# EAGLE schematic Board_Vesion_1_27_2015 (EAGLE 6.5.0)
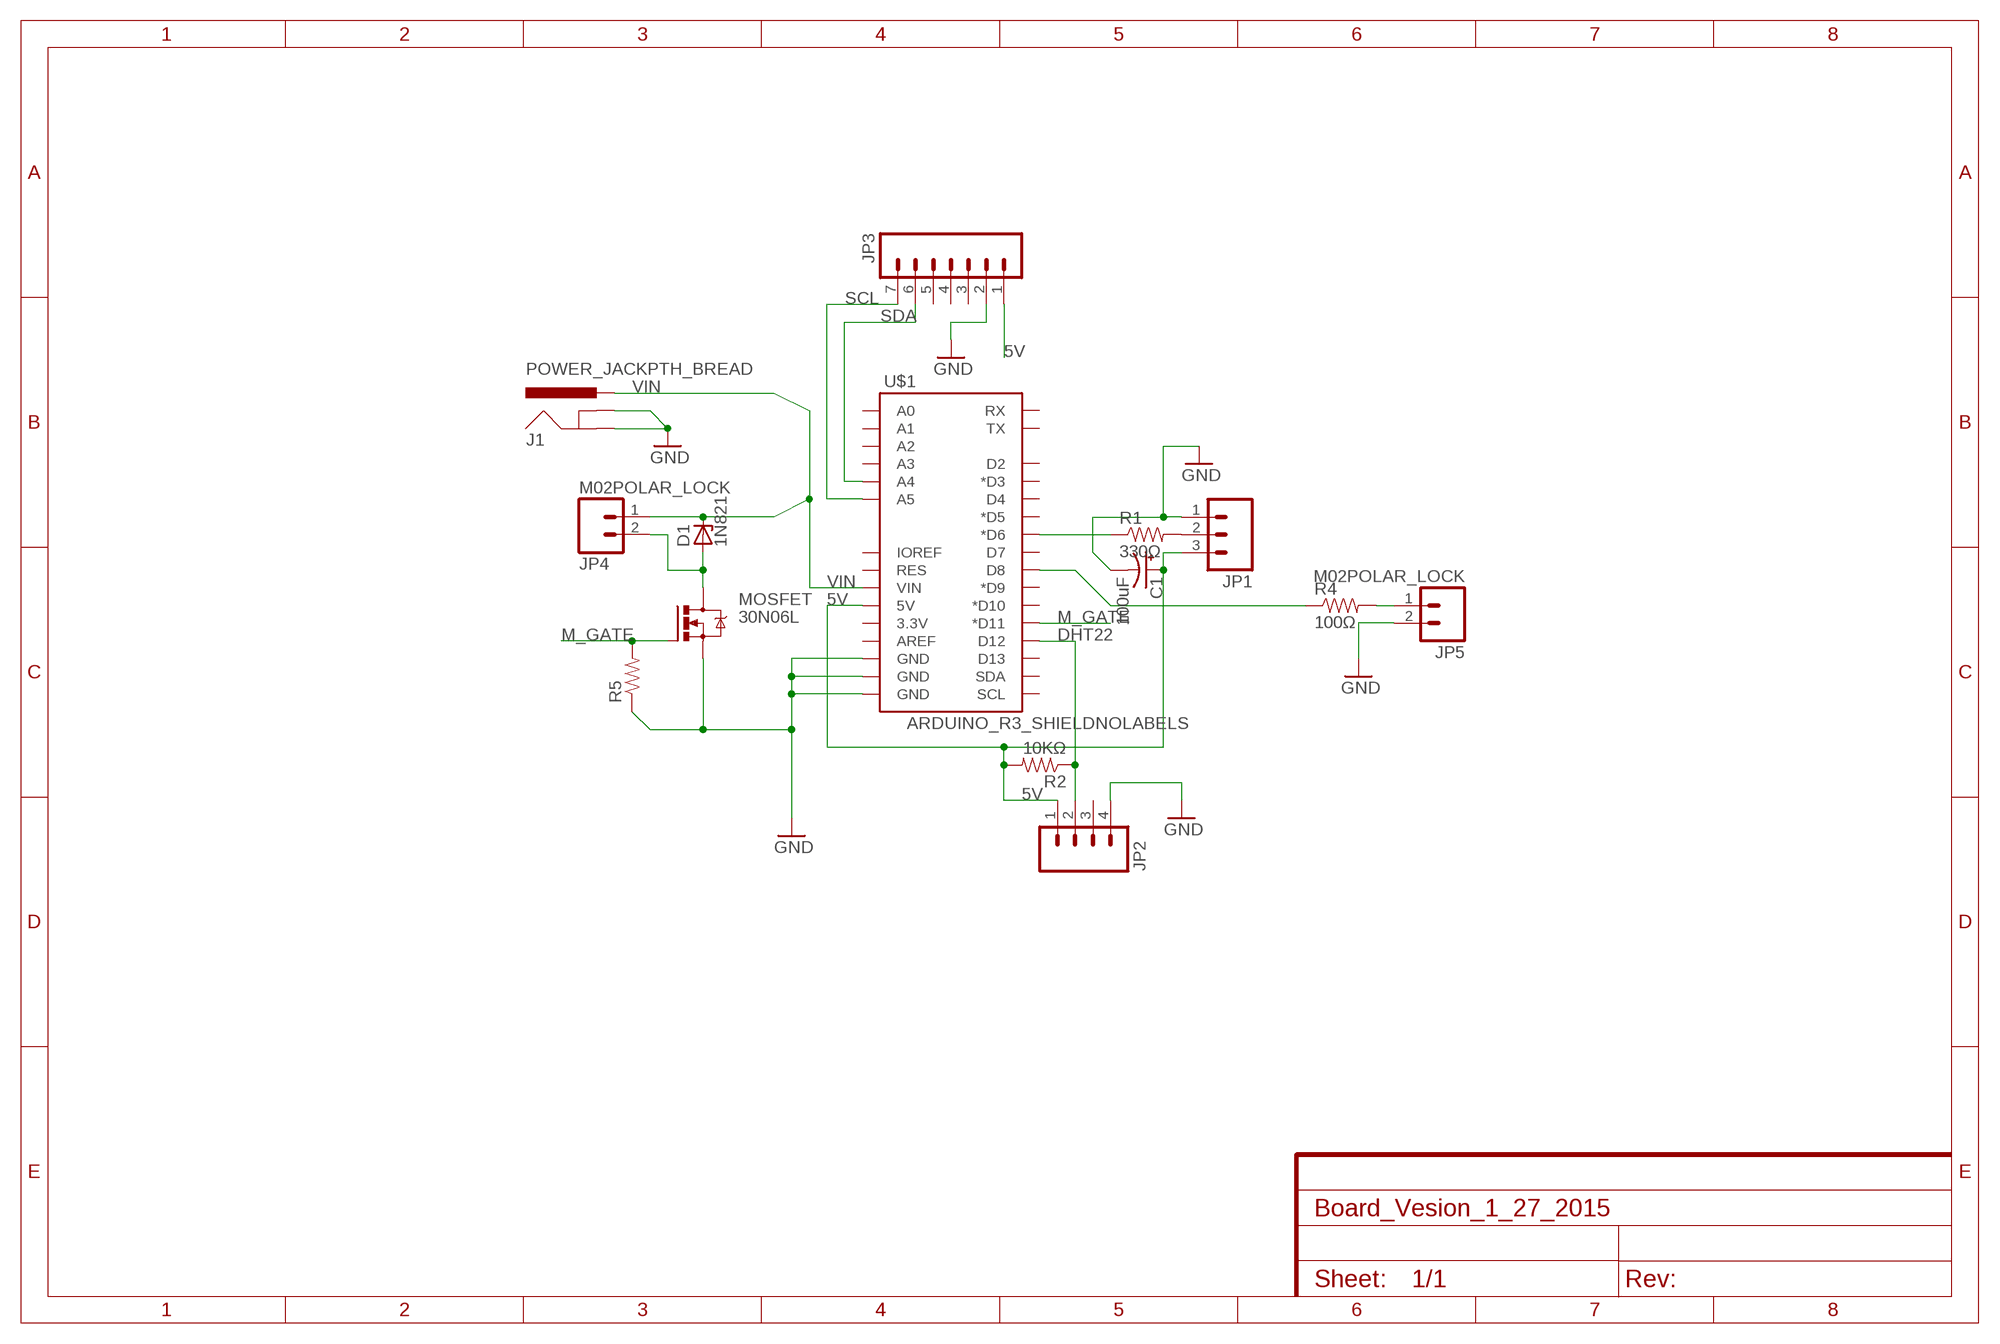
[diagram p0: schematic, sheet 1]

## Parts
C1  100uF  CAP_POLPTH2  [CPOL-RADIAL-10UF-25V]
D1  1N821  [DO35Z10]
J1  POWER_JACKPTH_BREAD  [POWER_JACK_PTH_BREAD]
JP1  M03LOCK_LONGPADS  [1X03_LOCK_LONGPADS]
JP2  M04LOCK_LONGPADS  [1X04_LOCK_LONGPADS]
JP3  M07LOCK_LONGPADS  [1X07_LOCK_LONGPADS]
JP4  M02POLAR_LOCK  [MOLEX-1X2_LOCK]
JP5  M02POLAR_LOCK  [MOLEX-1X2_LOCK]
MOSFET  30N06L  IRF740  [TO220BV]
R1  330Ω  RESISTORPTH-1/4W  [AXIAL-0.4]
R2  10KΩ  RESISTORPTH-1/4W  [AXIAL-0.4]
R4  100Ω  RESISTORPTH-1/4W  [AXIAL-0.4]
R5  RESISTORPTH-1W  [AXIAL-0.6]
U$1  ARDUINO_R3_SHIELDNOLABELS  [UNO_R3_SHIELD_NOLABELS]

## Nets
5V: C1.1(+) JP1.3 JP2.1 JP3.1 R2.P$2 U$1.5V
DHT22: JP2.2 R2.P$1 U$1.D12
GND: C1.2(-) J1.GND J1.GNDBREAK JP1.1 JP2.4 JP3.2 JP5.2 MOSFET.S R5.P$1 U$1.GND@0(GND) U$1.GND@1(GND) U$1.GND@2(GND)
M_GATE: MOSFET.G R5.P$2 U$1.D11(*D11)
N$1: JP1.2 R1.P$2
N$2: R4.P$1 U$1.D8
N$4: R1.P$1 U$1.D6(*D6)
N$5: D1.A JP4.2 MOSFET.D
N$6: JP5.1 R4.P$2
SCL: JP3.7 U$1.A5
SDA: JP3.6 U$1.A4
VIN: D1.C J1.PWR JP4.1 U$1.VIN
Unconnected: JP2.3 JP3.3 JP3.4 JP3.5 U$1.3.3V U$1.A0 U$1.A1 U$1.A2 U$1.A3 U$1.AREF U$1.D2 U$1.D3(*D3) U$1.D4 U$1.D5(*D5) U$1.D7 U$1.D9(*D9) U$1.D10(*D10) U$1.D13 U$1.IOREF U$1.RES U$1.RX U$1.SCL U$1.SDA U$1.TX

## Library data of the parts
C1 = SparkFun-Passives:CAP_POL: Capacitor Polarized These are standard SMD and PTH capacitors. Normally 10uF, 47uF, and 100uF in electrolytic and tantalum varieties. Always verify the external diameter of the through hole cap, it varies with capacity, voltage, and manufacturer. The EIA devices should be standard.
D1 = diode:1N821: Reference DIODE temperature compensated, 6,2 V
J1 = SparkFun-Connectors:POWER_JACK: Power Jack This is the standard 5.5mm barrel jack for power. The PTH is the most common, proven, reliable, footprint. The Slot footprint only works if the mill layer is transmitted to the PCB fab house so be warned. Mating wall wart : TOL-00298 (and others); PROD_ID: PRT-10811
JP1 = SparkFun-Connectors:M03: Header 3 Standard 3-pin 0.1" header. Use with straight break away headers (SKU : PRT-00116), right angle break away headers (PRT-00553), swiss pins (PRT-00743), machine pins (PRT-00117), and female headers (PRT-00115). Molex polarized connector foot print use with SKU : PRT-08232 with associated crimp pins and housings.
JP2 = SparkFun-Connectors:M04: Header 4 Standard 4-pin 0.1" header. Use with straight break away headers (SKU : PRT-00116), right angle break away headers (PRT-00553), swiss pins (PRT-00743), machine pins (PRT-00117), and female headers (PRT-00115). Molex polarized connector foot print use with SKU : PRT-08231 with associated crimp pins and housings. 1MM SMD Version SKU: PRT-10208
JP3 = SparkFun-Connectors:M07: Header 7 Standard 7-pin 0.1" header. Use with straight break away headers (SKU : PRT-00116), right angle break away headers (PRT-00553), swiss pins (PRT-00743), machine pins (PRT-00117), and female headers (PRT-00115). NOTES ON THE VARIANTS LOCK and LOCK_LONGPADS... This footprint was designed to help hold the alignment of a through-hole component (i.e. 7-pin header) while soldering it into place. You may notice that each hole has been shifted either up or down by 0.005 of an inch from it's more standard position (which is usually a perfectly straight line). This slight alteration caused the pins (the squares in the middle) to touch the edges of the holes. Because they are alternating, it causes a "brace" to hold the header in place. 0.005 has proven to be the perfect amount of "off-center" position when using our standard breakaway headers. Although looks a little odd when you look at the bare footprint, once you have a header in there, the alteration is very hard to notice. Also, if you push a header all the way into place, it is covered up entirely on the bottom side. This idea of altering the position of holes to aid alignment will be further integrated into the Sparkfun Library for other footprints. It can help hold any component with 3 or more connection pins.
JP4 JP5 = SparkFun-Connectors:M02: Standard 2-pin 0.1" header. Use with - straight break away headers ( PRT-00116) - right angle break away headers (PRT-00553) - swiss pins (PRT-00743) - machine pins (PRT-00117) - female headers (PRT-00115) Molex polarized connector foot print use with: PRT-08233 with associated crimp pins and housings. 2.54_SCREWTERM for use with PRT-10571. 3.5mm Screw Terminal footprints for PRT-08084 5mm Screw Terminal footprints for use with PRT-08433
MOSFET = transistor-power:IRF740: N-CHANNEL MOS FET
R1 R2 = SparkFun-Passives:RESISTOR: Resistor Basic schematic elements and footprints for 0603, 1206, and PTH resistors.
R4 R5 = SparkFun-Resistors:RESISTOR: Resistor Basic schematic elements and footprints for 0603, 1206, and PTH resistors.
U$1 = SparkFun-Boards:ARDUINO_R3_SHIELD: Shield form compatible with the Arduino Uno R3.